# Altium project Freezer Relay Control.PrjPcb
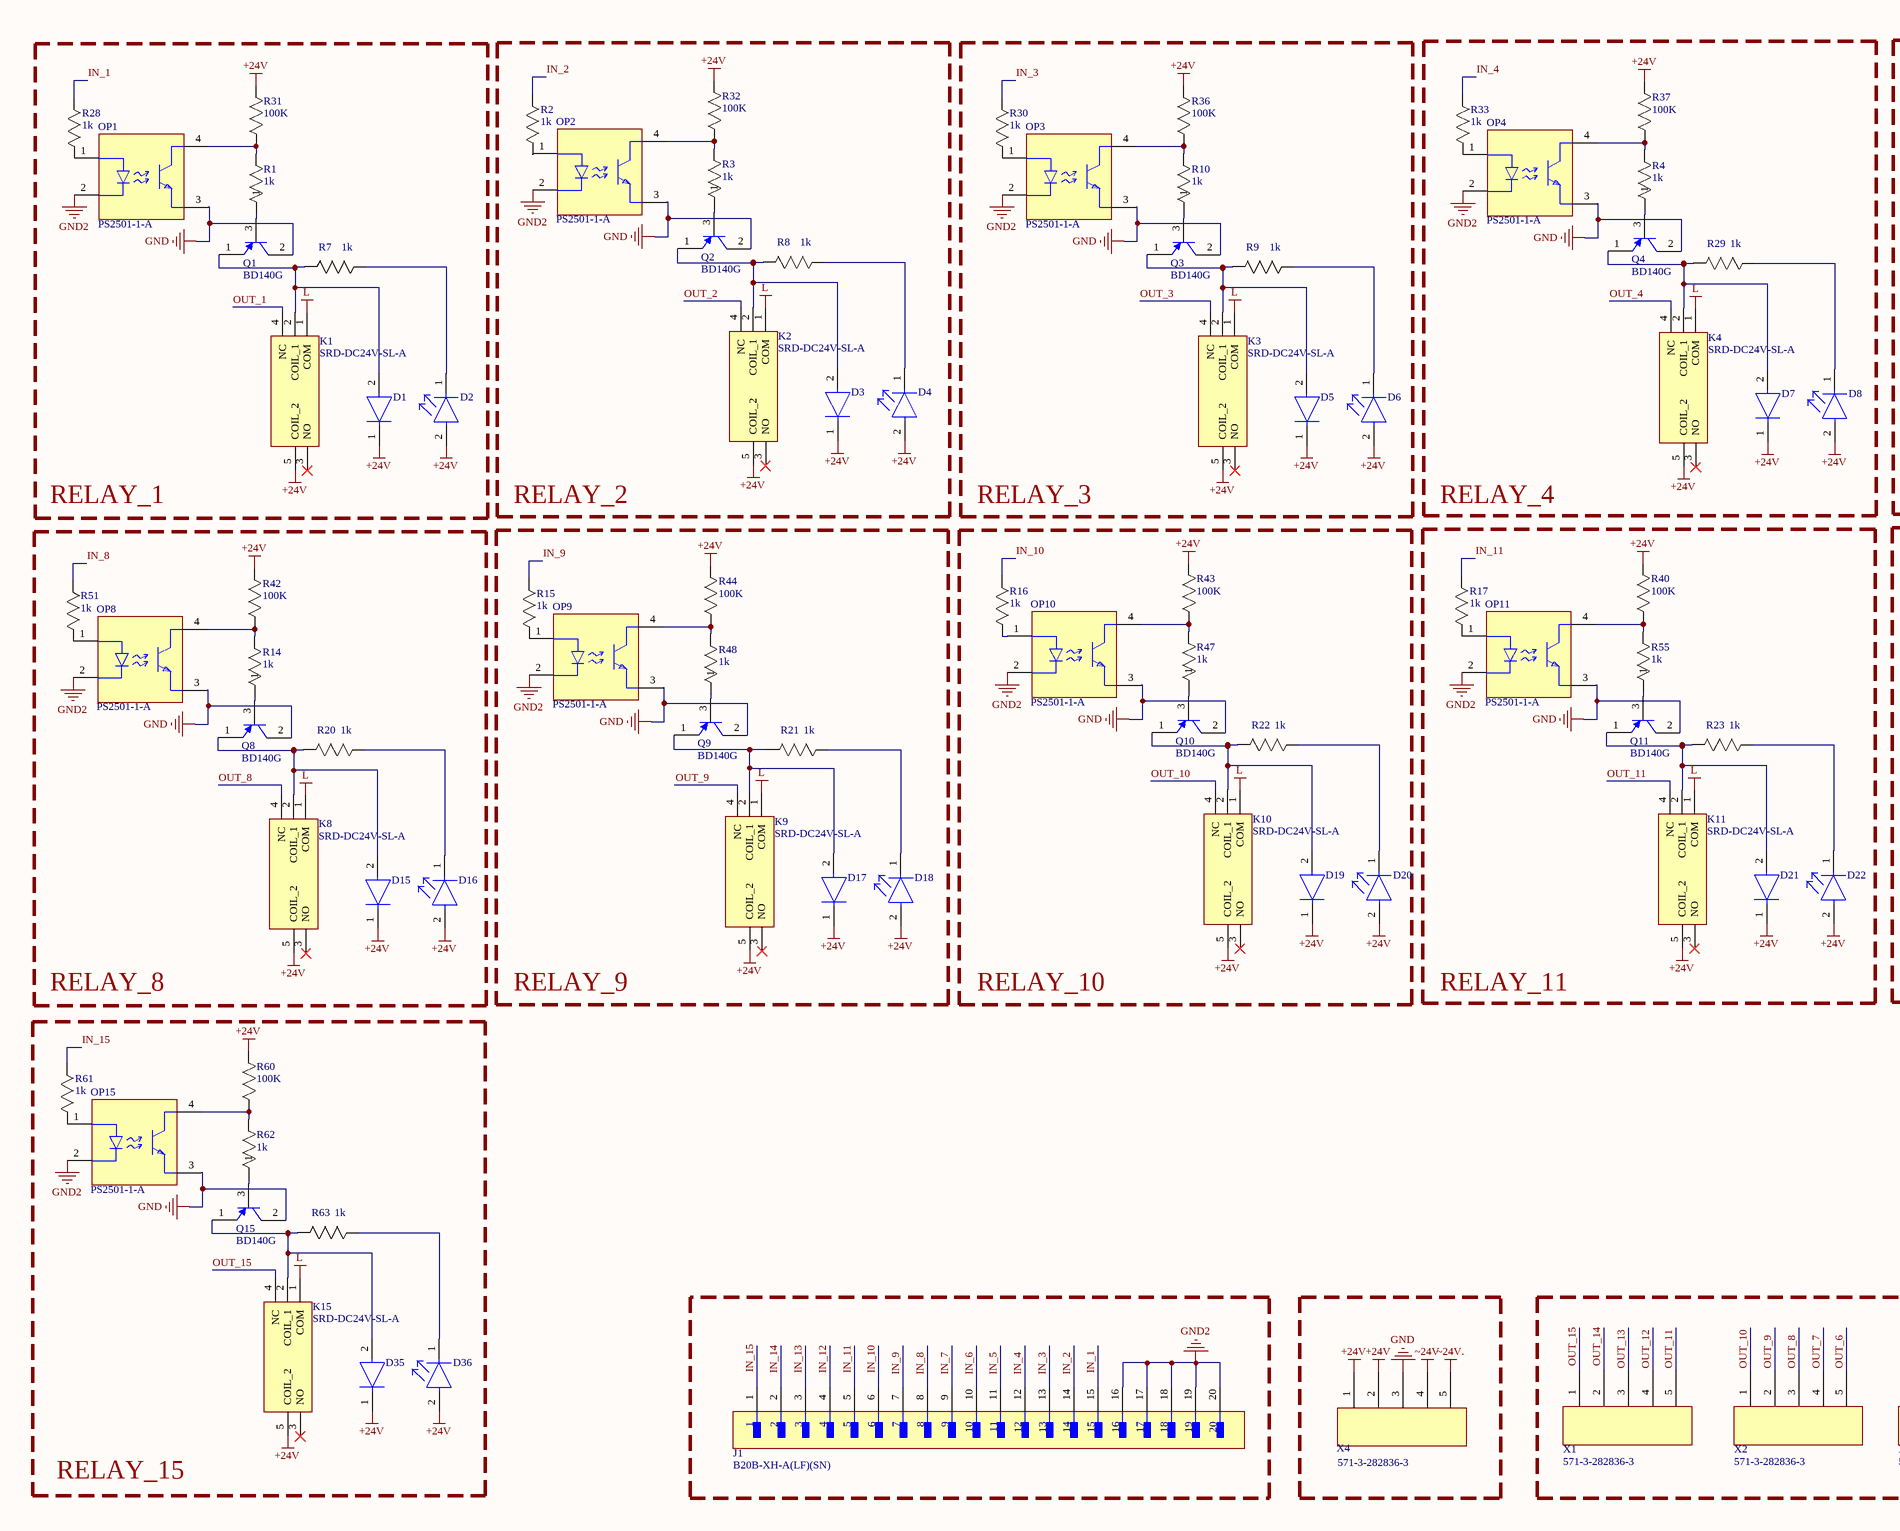
[diagram p0: Relay_Scch.SchDoc, left]
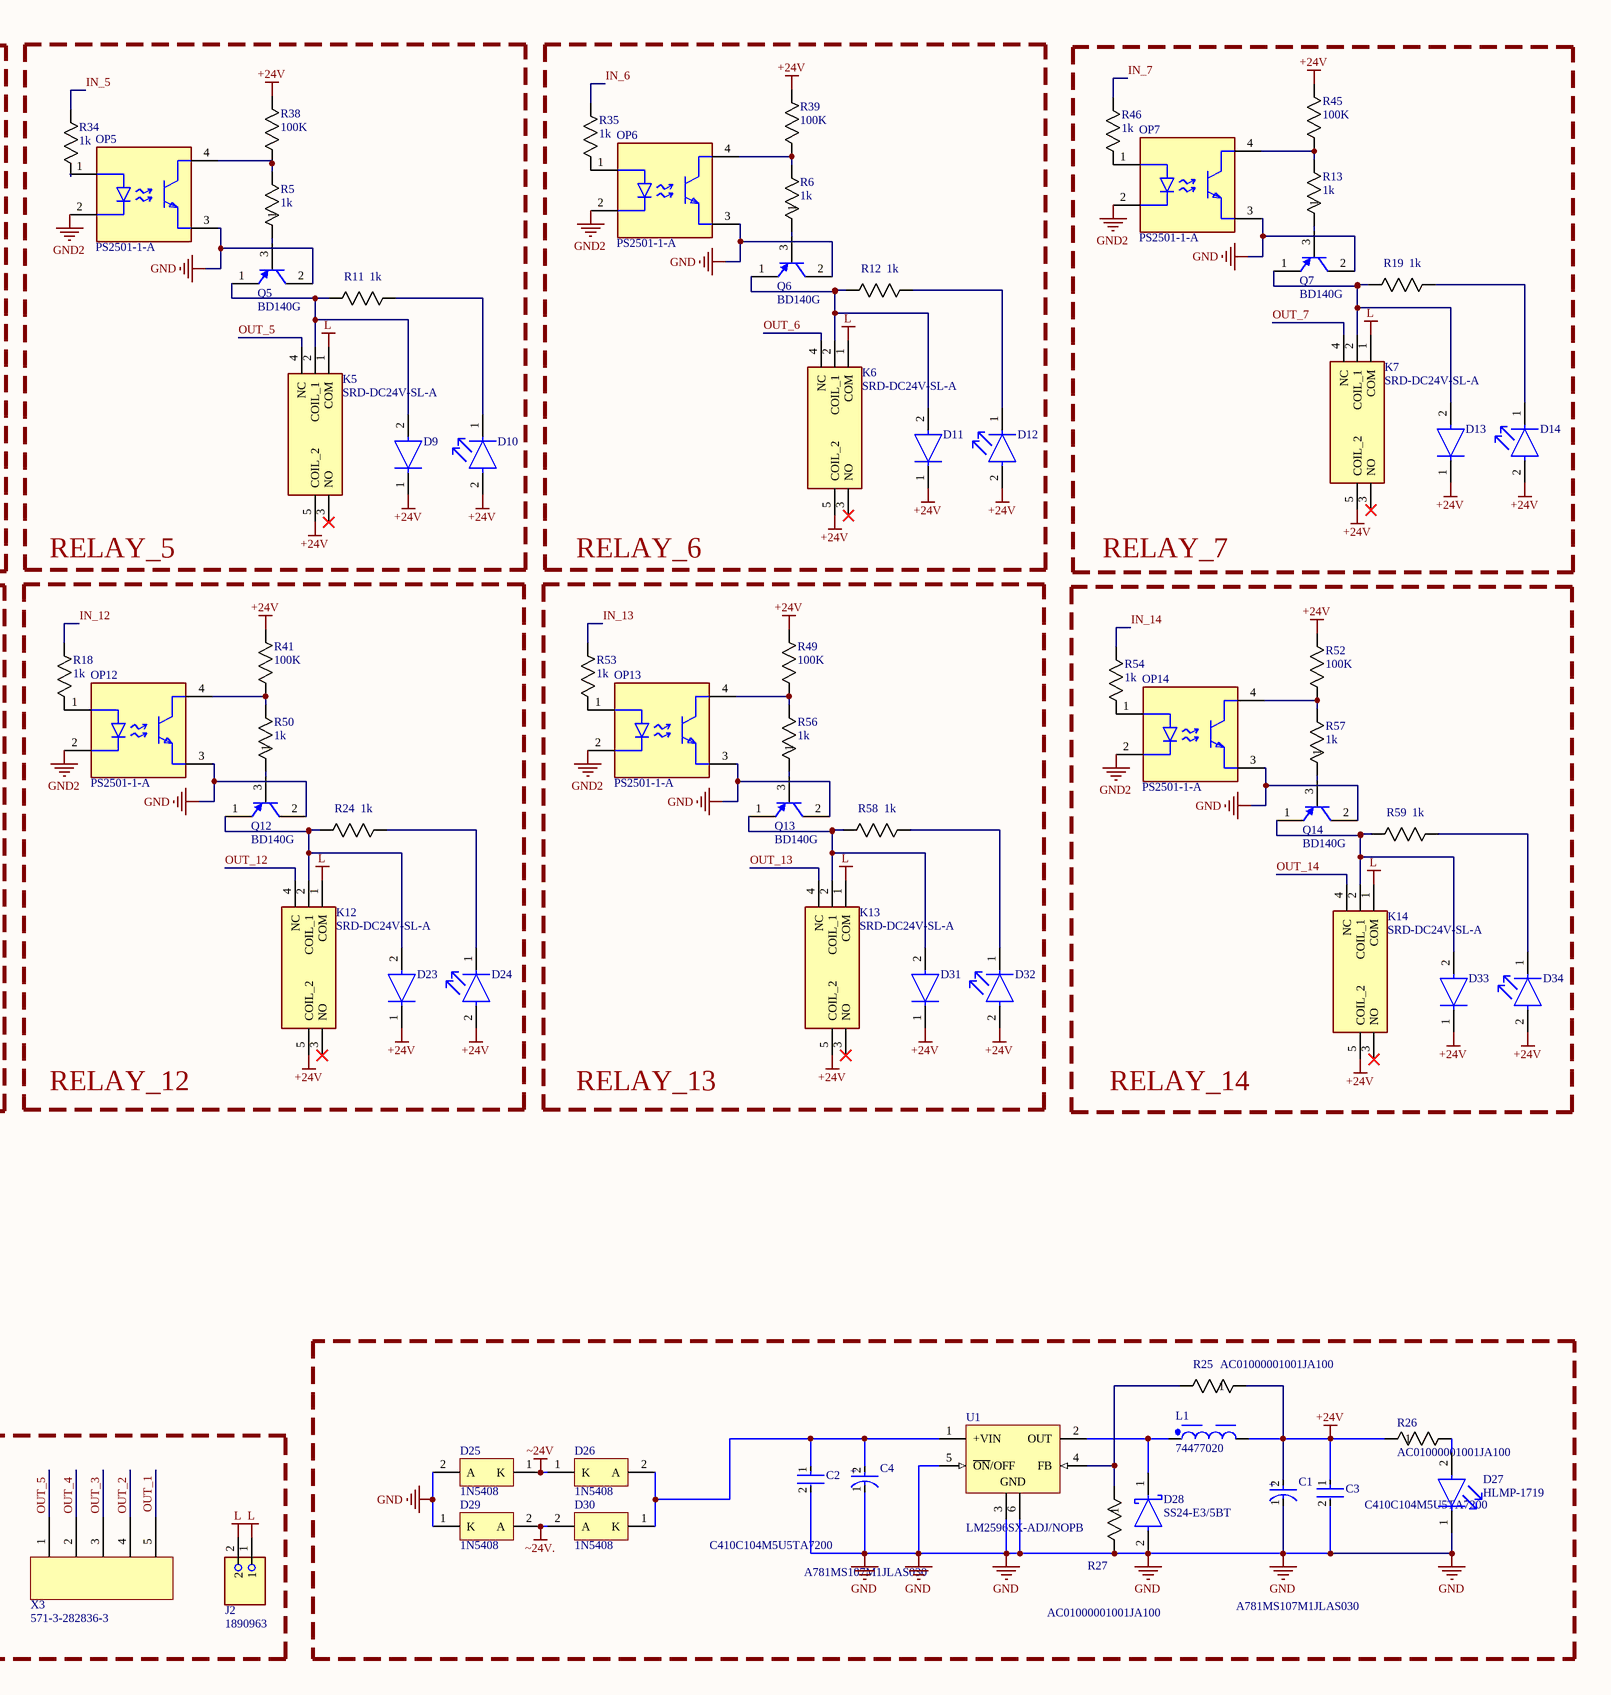
[diagram p1: Relay_Scch.SchDoc, right]
1 sheet, 156 parts. Net scope: global (net labels, ports and power ports of the same name join across sheets).
Board file: Relay_PCB.PcbDoc

## Sheet Relay_Scch.SchDoc
size 762 x 330 mm; SheetNumber: 1; SheetTotal: 1

### Parts
C1  A781MS107M1JLAS030  [FP-A781MS-S-MFG]
C2  C410C104M5U5TA7200  [FP-C410C104M5U5TA7200-MFG]
C3  C410C104M5U5TA7200  [FP-C410C104M5U5TA7200-MFG]
C4  A781MS107M1JLAS030  [FP-A781MS-S-MFG]
D1  1N4007  [FP-1N4007-MFG]  (value not drawn)
D2  HLMP-1719  [FP-HLMP-1719-MFG]  (value not drawn)
D3  1N4007  [FP-1N4007-MFG]  (value not drawn)
D4  HLMP-1719  [FP-HLMP-1719-MFG]  (value not drawn)
D5  1N4007  [FP-1N4007-MFG]  (value not drawn)
D6  HLMP-1719  [FP-HLMP-1719-MFG]  (value not drawn)
D7  1N4007  [FP-1N4007-MFG]  (value not drawn)
D8  HLMP-1719  [FP-HLMP-1719-MFG]  (value not drawn)
D9  1N4007  [FP-1N4007-MFG]  (value not drawn)
D10  HLMP-1719  [FP-HLMP-1719-MFG]  (value not drawn)
D11  1N4007  [FP-1N4007-MFG]  (value not drawn)
D12  HLMP-1719  [FP-HLMP-1719-MFG]  (value not drawn)
D13  1N4007  [FP-1N4007-MFG]  (value not drawn)
D14  HLMP-1719  [FP-HLMP-1719-MFG]  (value not drawn)
D15  1N4007  [FP-1N4007-MFG]  (value not drawn)
D16  HLMP-1719  [FP-HLMP-1719-MFG]  (value not drawn)
D17  1N4007  [FP-1N4007-MFG]  (value not drawn)
D18  HLMP-1719  [FP-HLMP-1719-MFG]  (value not drawn)
D19  1N4007  [FP-1N4007-MFG]  (value not drawn)
D20  HLMP-1719  [FP-HLMP-1719-MFG]  (value not drawn)
D21  1N4007  [FP-1N4007-MFG]  (value not drawn)
D22  HLMP-1719  [FP-HLMP-1719-MFG]  (value not drawn)
D23  1N4007  [FP-1N4007-MFG]  (value not drawn)
D24  HLMP-1719  [FP-HLMP-1719-MFG]  (value not drawn)
D25  1N5408  [ONSC-AXIAL_LEAD-2-267-05_V]
D26  1N5408  [ONSC-AXIAL_LEAD-2-267-05_V]
D27  HLMP-1719  [FP-HLMP-1719-MFG]
D28  SS24-E3/5BT  [FP-95401-MFG]
D29  1N5408  [ONSC-AXIAL_LEAD-2-267-05_V]
D30  1N5408  [ONSC-AXIAL_LEAD-2-267-05_V]
D31  1N4007  [FP-1N4007-MFG]  (value not drawn)
D32  HLMP-1719  [FP-HLMP-1719-MFG]  (value not drawn)
D33  1N4007  [FP-1N4007-MFG]  (value not drawn)
D34  HLMP-1719  [FP-HLMP-1719-MFG]  (value not drawn)
D35  1N4007  [FP-1N4007-MFG]  (value not drawn)
D36  HLMP-1719  [FP-HLMP-1719-MFG]  (value not drawn)
J1  B20B-XH-A(LF)(SN)  [FP-B20B-XH-A_LF_SN-MFG]
J2  1890963  [PHOENIX_1890963]
K1  SRD-DC24V-SL-A  [srd24vdcslc]
K2  SRD-DC24V-SL-A  [srd24vdcslc]
K3  SRD-DC24V-SL-A  [srd24vdcslc]
K4  SRD-DC24V-SL-A  [srd24vdcslc]
K5  SRD-DC24V-SL-A  [srd24vdcslc]
K6  SRD-DC24V-SL-A  [srd24vdcslc]
K7  SRD-DC24V-SL-A  [srd24vdcslc]
K8  SRD-DC24V-SL-A  [srd24vdcslc]
K9  SRD-DC24V-SL-A  [srd24vdcslc]
K10  SRD-DC24V-SL-A  [srd24vdcslc]
K11  SRD-DC24V-SL-A  [srd24vdcslc]
K12  SRD-DC24V-SL-A  [srd24vdcslc]
K13  SRD-DC24V-SL-A  [srd24vdcslc]
K14  SRD-DC24V-SL-A  [srd24vdcslc]
K15  SRD-DC24V-SL-A  [srd24vdcslc]
L1  74477020  [WE-PD_1280]
OP1  PS2501-1-A  [FP-PS2501-1-A-MFG]
OP2  PS2501-1-A  [FP-PS2501-1-A-MFG]
OP3  PS2501-1-A  [FP-PS2501-1-A-MFG]
OP4  PS2501-1-A  [FP-PS2501-1-A-MFG]
OP5  PS2501-1-A  [FP-PS2501-1-A-MFG]
OP6  PS2501-1-A  [FP-PS2501-1-A-MFG]
OP7  PS2501-1-A  [FP-PS2501-1-A-MFG]
OP8  PS2501-1-A  [FP-PS2501-1-A-MFG]
OP9  PS2501-1-A  [FP-PS2501-1-A-MFG]
OP10  PS2501-1-A  [FP-PS2501-1-A-MFG]
OP11  PS2501-1-A  [FP-PS2501-1-A-MFG]
OP12  PS2501-1-A  [FP-PS2501-1-A-MFG]
OP13  PS2501-1-A  [FP-PS2501-1-A-MFG]
OP14  PS2501-1-A  [FP-PS2501-1-A-MFG]
OP15  PS2501-1-A  [FP-PS2501-1-A-MFG]
Q1  BD140G  [ONSC-TO-225-3-77-09]
Q2  BD140G  [ONSC-TO-225-3-77-09]
Q3  BD140G  [ONSC-TO-225-3-77-09]
Q4  BD140G  [ONSC-TO-225-3-77-09]
Q5  BD140G  [ONSC-TO-225-3-77-09]
Q6  BD140G  [ONSC-TO-225-3-77-09]
Q7  BD140G  [ONSC-TO-225-3-77-09]
Q8  BD140G  [ONSC-TO-225-3-77-09]
Q9  BD140G  [ONSC-TO-225-3-77-09]
Q10  BD140G  [ONSC-TO-225-3-77-09]
Q11  BD140G  [ONSC-TO-225-3-77-09]
Q12  BD140G  [ONSC-TO-225-3-77-09]
Q13  BD140G  [ONSC-TO-225-3-77-09]
Q14  BD140G  [ONSC-TO-225-3-77-09]
Q15  BD140G  [ONSC-TO-225-3-77-09]
R1  1k  [RES_AC01_VIS]
R2  1k  [RES_AC01_VIS]
R3  1k  [RES_AC01_VIS]
R4  1k  [RES_AC01_VIS]
R5  1k  [RES_AC01_VIS]
R6  1k  [RES_AC01_VIS]
R7  1k  [RES_AC01_VIS]
R8  1k  [RES_AC01_VIS]
R9  1k  [RES_AC01_VIS]
R10  1k  [RES_AC01_VIS]
R11  1k  [RES_AC01_VIS]
R12  1k  [RES_AC01_VIS]
R13  1k  [RES_AC01_VIS]
R14  1k  [RES_AC01_VIS]
R15  1k  [RES_AC01_VIS]
R16  1k  [RES_AC01_VIS]
R17  1k  [RES_AC01_VIS]
R18  1k  [RES_AC01_VIS]
R19  1k  [RES_AC01_VIS]
R20  1k  [RES_AC01_VIS]
R21  1k  [RES_AC01_VIS]
R22  1k  [RES_AC01_VIS]
R23  1k  [RES_AC01_VIS]
R24  1k  [RES_AC01_VIS]
R25  AC01000001001JA100  [RES_AC01_VIS]
R26  AC01000001001JA100  [RES_AC01_VIS]
R27  AC01000001001JA100  [RES_AC01_VIS]
R28  1k  [RES_AC01_VIS]
R29  1k  [RES_AC01_VIS]
R30  1k  [RES_AC01_VIS]
R31  100K  [RES_AC01_VIS]
R32  100K  [RES_AC01_VIS]
R33  1k  [RES_AC01_VIS]
R34  1k  [RES_AC01_VIS]
R35  1k  [RES_AC01_VIS]
R36  100K  [RES_AC01_VIS]
R37  100K  [RES_AC01_VIS]
R38  100K  [RES_AC01_VIS]
R39  100K  [RES_AC01_VIS]
R40  100K  [RES_AC01_VIS]
R41  100K  [RES_AC01_VIS]
R42  100K  [RES_AC01_VIS]
R43  100K  [RES_AC01_VIS]
R44  100K  [RES_AC01_VIS]
R45  100K  [RES_AC01_VIS]
R46  1k  [RES_AC01_VIS]
R47  1k  [RES_AC01_VIS]
R48  1k  [RES_AC01_VIS]
R49  100K  [RES_AC01_VIS]
R50  1k  [RES_AC01_VIS]
R51  1k  [RES_AC01_VIS]
R52  100K  [RES_AC01_VIS]
R53  1k  [RES_AC01_VIS]
R54  1k  [RES_AC01_VIS]
R55  1k  [RES_AC01_VIS]
R56  1k  [RES_AC01_VIS]
R57  1k  [RES_AC01_VIS]
R58  1k  [RES_AC01_VIS]
R59  1k  [RES_AC01_VIS]
R60  100K  [RES_AC01_VIS]
R61  1k  [RES_AC01_VIS]
R62  1k  [RES_AC01_VIS]
R63  1k  [RES_AC01_VIS]
U1  LM2596SX-ADJ/NOPB  [KTT0005B_L]
X1  571-3-282836-3  [PCBComponent_1]
X2  571-3-282836-3  [PCBComponent_1]
X3  571-3-282836-3  [PCBComponent_1]
X4  571-3-282836-3  [PCBComponent_1]

### Blocks framed on the sheet
RELAY_1: D1 D2 K1 OP1 Q1 R1 R7 R28 R31
RELAY_2: D3 D4 K2 OP2 Q2 R2 R3 R8 R32
RELAY_3: D5 D6 K3 OP3 Q3 R9 R10 R30 R36
RELAY_4: D7 D8 K4 OP4 Q4 R4 R29 R33 R37
RELAY_5: D9 D10 K5 OP5 Q5 R5 R11 R34 R38
RELAY_6: D11 D12 K6 OP6 Q6 R6 R12 R35 R39
RELAY_7: D13 D14 K7 OP7 Q7 R13 R19 R45 R46
RELAY_8: D15 D16 K8 OP8 Q8 R14 R20 R42 R51
RELAY_9: D17 D18 K9 OP9 Q9 R15 R21 R44 R48
RELAY_10: D19 D20 K10 OP10 Q10 R16 R22 R43 R47
RELAY_11: D21 D22 K11 OP11 Q11 R17 R23 R40 R55
RELAY_12: D23 D24 K12 OP12 Q12 R18 R24 R41 R50
RELAY_13: D31 D32 K13 OP13 Q13 R49 R53 R56 R58
RELAY_14: D33 D34 K14 OP14 Q14 R52 R54 R57 R59
RELAY_15: D35 D36 K15 OP15 Q15 R60-R63

### Nets
+24V: C1.2(A) C3.1 D1.1(C) D2.2(A) D3.1(C) D4.2(A) D5.1(C) D6.2(A) D7.1(C) D8.2(A) D9.1(C) D10.2(A) D11.1(C) D12.2(A) D13.1(C) D14.2(A) D15.1(C) D16.2(A) D17.1(C) D18.2(A) D19.1(C) D20.2(A) D21.1(C) D22.2(A) D23.1(C) D24.2(A) D31.1(C) D32.2(A) D33.1(C) D34.2(A) D35.1(C) D36.2(A) K1.5(COIL_2) K2.5(COIL_2) K3.5(COIL_2) K4.5(COIL_2) K5.5(COIL_2) K6.5(COIL_2) K7.5(COIL_2) K8.5(COIL_2) K9.5(COIL_2) K10.5(COIL_2) K11.5(COIL_2) K12.5(COIL_2) K13.5(COIL_2) K14.5(COIL_2) K15.5(COIL_2) L1.2 R25.1 R26.1 R31.2 R32.2 R36.2 R37.2 R38.2 R39.2 R40.2 R41.2 R42.2 R43.2 R44.2 R45.2 R49.2 R52.2 R60.2 X4.1 X4.2
GND: C1.1(C) C2.2 C3.2 C4.1(C) D25.2(A) D27.1(C) D28.2(A) D29.1(K) OP1.3(E) OP2.3(E) OP3.3(E) OP4.3(E) OP5.3(E) OP6.3(E) OP7.3(E) OP8.3(E) OP9.3(E) OP10.3(E) OP11.3(E) OP12.3(E) OP13.3(E) OP14.3(E) OP15.3(E) Q1.2(C) Q2.2(C) Q3.2(C) Q4.2(C) Q5.2(C) Q6.2(C) Q7.2(C) Q8.2(C) Q9.2(C) Q10.2(C) Q11.2(C) Q12.2(C) Q13.2(C) Q14.2(C) Q15.2(C) R27.2 U1.3(GND) U1.5(~{ON}/OFF) U1.6(GND) X4.3
GND2: J1.16 J1.17 J1.18 J1.19 J1.20 OP1.2(C) OP2.2(C) OP3.2(C) OP4.2(C) OP5.2(C) OP6.2(C) OP7.2(C) OP8.2(C) OP9.2(C) OP10.2(C) OP11.2(C) OP12.2(C) OP13.2(C) OP14.2(C) OP15.2(C)
L: J2.1 J2.2 K1.1(COM) K2.1(COM) K3.1(COM) K4.1(COM) K5.1(COM) K6.1(COM) K7.1(COM) K8.1(COM) K9.1(COM) K10.1(COM) K11.1(COM) K12.1(COM) K13.1(COM) K14.1(COM) K15.1(COM)
~24V: D25.1(K) D26.1(K) X4.4
~24V.: D29.2(A) D30.2(A) X4.5
IN_1: J1.15 R28.1
IN_2: J1.14 R2.1
IN_3: J1.13 R30.1
IN_4: J1.12 R33.1
IN_5: J1.11 R34.1
IN_6: J1.10 R35.1
IN_7: J1.9 R46.1
IN_8: J1.8 R51.1
IN_9: J1.7 R15.1
IN_10: J1.6 R16.1
IN_11: J1.5 R17.1
IN_12: J1.4 R18.1
IN_13: J1.3 R53.1
IN_14: J1.2 R54.1
IN_15: J1.1 R61.1
OUT_1: K1.4(NC) X3.5
OUT_2: K2.4(NC) X3.4
OUT_3: K3.4(NC) X3.3
OUT_4: K4.4(NC) X3.2
OUT_5: K5.4(NC) X3.1
OUT_6: K6.4(NC) X2.5
OUT_7: K7.4(NC) X2.4
OUT_8: K8.4(NC) X2.3
OUT_9: K9.4(NC) X2.2
OUT_10: K10.4(NC) X2.1
OUT_11: K11.4(NC) X1.5
OUT_12: K12.4(NC) X1.4
OUT_13: K13.4(NC) X1.3
OUT_14: K14.4(NC) X1.2
OUT_15: K15.4(NC) X1.1
NetC2_1: C2.1 C4.2(A) D26.2(A) D30.1(K) U1.1(+VIN)
NetD1_2: D1.2(A) K1.2(COIL_1) Q1.1(E) R7.2
NetD2_1: D2.1(C) R7.1
NetD3_2: D3.2(A) K2.2(COIL_1) Q2.1(E) R8.2
NetD4_1: D4.1(C) R8.1
NetD5_2: D5.2(A) K3.2(COIL_1) Q3.1(E) R9.2
NetD6_1: D6.1(C) R9.1
NetD7_2: D7.2(A) K4.2(COIL_1) Q4.1(E) R29.2
NetD8_1: D8.1(C) R29.1
NetD9_2: D9.2(A) K5.2(COIL_1) Q5.1(E) R11.2
NetD10_1: D10.1(C) R11.1
NetD11_2: D11.2(A) K6.2(COIL_1) Q6.1(E) R12.2
NetD12_1: D12.1(C) R12.1
NetD13_2: D13.2(A) K7.2(COIL_1) Q7.1(E) R19.2
NetD14_1: D14.1(C) R19.1
NetD15_2: D15.2(A) K8.2(COIL_1) Q8.1(E) R20.2
NetD16_1: D16.1(C) R20.1
NetD17_2: D17.2(A) K9.2(COIL_1) Q9.1(E) R21.2
NetD18_1: D18.1(C) R21.1
NetD19_2: D19.2(A) K10.2(COIL_1) Q10.1(E) R22.2
NetD20_1: D20.1(C) R22.1
NetD21_2: D21.2(A) K11.2(COIL_1) Q11.1(E) R23.2
NetD22_1: D22.1(C) R23.1
NetD23_2: D23.2(A) K12.2(COIL_1) Q12.1(E) R24.2
NetD24_1: D24.1(C) R24.1
NetD27_2: D27.2(A) R26.2
NetD28_1: D28.1(C) L1.1 U1.2(OUT)
NetD31_2: D31.2(A) K13.2(COIL_1) Q13.1(E) R58.2
NetD32_1: D32.1(C) R58.1
NetD33_2: D33.2(A) K14.2(COIL_1) Q14.1(E) R59.2
NetD34_1: D34.1(C) R59.1
NetD35_2: D35.2(A) K15.2(COIL_1) Q15.1(E) R63.2
NetD36_1: D36.1(C) R63.1
NetOP1_1: OP1.1(A) R28.2
NetOP1_4: OP1.4(C) R1.2 R31.1
NetOP2_1: OP2.1(A) R2.2
NetOP2_4: OP2.4(C) R3.2 R32.1
NetOP3_1: OP3.1(A) R30.2
NetOP3_4: OP3.4(C) R10.2 R36.1
NetOP4_1: OP4.1(A) R33.2
NetOP4_4: OP4.4(C) R4.2 R37.1
NetOP5_1: OP5.1(A) R34.2
NetOP5_4: OP5.4(C) R5.2 R38.1
NetOP6_1: OP6.1(A) R35.2
NetOP6_4: OP6.4(C) R6.2 R39.1
NetOP7_1: OP7.1(A) R46.2
NetOP7_4: OP7.4(C) R13.2 R45.1
NetOP8_1: OP8.1(A) R51.2
NetOP8_4: OP8.4(C) R14.2 R42.1
NetOP9_1: OP9.1(A) R15.2
NetOP9_4: OP9.4(C) R44.1 R48.2
NetOP10_1: OP10.1(A) R16.2
NetOP10_4: OP10.4(C) R43.1 R47.2
NetOP11_1: OP11.1(A) R17.2
NetOP11_4: OP11.4(C) R40.1 R55.2
NetOP12_1: OP12.1(A) R18.2
NetOP12_4: OP12.4(C) R41.1 R50.2
NetOP13_1: OP13.1(A) R53.2
NetOP13_4: OP13.4(C) R49.1 R56.2
NetOP14_1: OP14.1(A) R54.2
NetOP14_4: OP14.4(C) R52.1 R57.2
NetOP15_1: OP15.1(A) R61.2
NetOP15_4: OP15.4(C) R60.1 R62.2
NetQ1_3: Q1.3(B) R1.1
NetQ2_3: Q2.3(B) R3.1
NetQ3_3: Q3.3(B) R10.1
NetQ4_3: Q4.3(B) R4.1
NetQ5_3: Q5.3(B) R5.1
NetQ6_3: Q6.3(B) R6.1
NetQ7_3: Q7.3(B) R13.1
NetQ8_3: Q8.3(B) R14.1
NetQ9_3: Q9.3(B) R48.1
NetQ10_3: Q10.3(B) R47.1
NetQ11_3: Q11.3(B) R55.1
NetQ12_3: Q12.3(B) R50.1
NetQ13_3: Q13.3(B) R56.1
NetQ14_3: Q14.3(B) R57.1
NetQ15_3: Q15.3(B) R62.1
NetR25_2: R25.2 R27.1 U1.4(FB)

Not connected (* = marked no-connect by the designer): K1 3(NO)*; K2 3(NO)*; K3 3(NO)*; K4 3(NO)*; K5 3(NO)*; K6 3(NO)*; K7 3(NO)*; K8 3(NO)*; K9 3(NO)*; K10 3(NO)*; K11 3(NO)*; K12 3(NO)*; K13 3(NO)*; K14 3(NO)*; K15 3(NO)*

### Notes on the sheet
- (in symbol CMP-03016-000042-1) +

### Library data of the parts
C1 C4 = CMP-03016-000042-1: HYBRID POLYMER, V-CHIP, AEC-Q200
C2 C3 = CMP-03020-034640-1: CAP CER 0.1UF 50V Z5U AXIAL; Capacitance: 100nF; Tolerance: 20%; Lead Diameter: 0.51mm; Dissipation Factor: 4%; Lead Length: 25.4mm; Mount: Through Hole; Length: 4.32mm; Lead Free: Lead Free; Number of Pins: 2; Case/Package: Axial; Max Operating Temperature: 85°C; RoHS Compliant: Yes; Dielectric: Z5U; Min Operating Temperature: 10°C; Series: Aximax 400; Termination: Axial; Radiation Hardening: No; Voltage Rating (DC): 50V; REACH SVHC: No SVHC; Construction: AXIAL; Package Quantity: 5000; Packaging: Tape and Reel; Voltage Rating: 50V
D1 D3 D5 D7 D9 D11 D13 D15 D17 D19 D21 D23 D31 D33 D35 = CMP-123542-000001-1: Rectifier diode 1000 V 1 A DO-41, ,; Manufacturer: Diotec; Max Surge Forward Current: 27A; Forward Current: 1A; Max Junction Temp: +175°C; Reverse Voltage: 1000V; Value: 15pF; Peak Reverse Current: 5uA; Category: Diode; Temperature Range Low: -50°C; Automotive: No; Temperature: -50°C to +175°C; Lead Free: Yes; ComponentLink2Description: Datasheet; Max Repetitive Reverse Voltage: 1000V; ComponentLink2URL: https://datasheet.octopart.com/1N4007-Diotec-datasheet-62346875.pdf; Manufacturer Part Number: 1N4007; Device Class L3: Rectifier Diodes; Height: 2.8mm; Octopart: https://octopart.com/1n4007-diotec-4040411; Package: 1N4007; Temperature Range High: +175°C; Device Class L1: Discrete Semiconductors; Device Class L2: Diodes; RoHS: TRUE; Capacitance: 15pF; Ipc Land Pattern Name: DIOAD888W100L520D280
D2 D4 D6 D8 D10 D12 D14 D16 D18 D20 D22 D24 D27 D32 D34 D36 = CMP-2000-06410-2: LED YELLOW DIFFUSED T-1 T/H; Manufacturer: Broadcom; Wavelength: 585nm; Led Orientation: Straight; Luminous Intensity: 2.1mcd; Forward Voltage: 1.8V; Viewing Angle: 50°; Reverse Voltage: 5V; Power Dissipation: 17.5mW; Forward Current: 2mA; Lead Free: Yes; Automotive: No; Device Class L1: Optoelectronics; Mouser Description: Standard LEDs - Through Hole Yellow Diffused 585nm 2.1mcd; Digikey Description: LED YELLOW DIFFUSED T-1 T/H; Temperature: -40°C to +100°C; Temperature Range High: +100°C; Package: 0; Category: Diode; Colour: Yellow; Device Class L2: LEDs; ComponentLink2Description: Datasheet; ComponentLink2URL: https://docs.broadcom.com/docs/AV02-1557EN; Temperature Range Low: -40°C; Device Class L3: unset; Octopart: https://octopart.com/hlmp-1719-broadcom-71130405; RoHS: TRUE; Manufacturer Part Number: HLMP-1719
D25 D26 D29 D30 = CMP-0902-00037-1: Standard Recovery Rectifier, 2-Pin Axial_Lead, Pb-Free, Bulk Box; Manufacturer: On Semiconductor; IFSM Max (A): 200; IO(rec) Max (A): 3; VRRM Max (V): 1000; RoHS: TRUE; ComponentLink3URL: http://www.onsemi.com/pub_link/Collateral/267-05.PDF; ComponentLink2URL: http://www.onsemi.com/pub_link/Collateral/1N5400-D.PDF; ComponentLink3Description: Package Specification; Mounting Technology: Through Hole; PartNumber: 1N5408; Type: Standard Recovery; PackageDescription: 2-Pin, Axial Lead, Diameter 5.05 mm; Packing: Bulk Box; PackageReference: AXIAL_LEAD-2-267-05; ComponentLink2Description: Datasheet; DatasheetVersion: Rev. 10; ComponentLink1Description: Manufacturer URL; PackageVersion: Rev. G, 06/2000; ComponentLink1URL: http://www.onsemi.com/
D28 = CMP-00030-42277690-1: SS24-E3/5BT Rectifier Diode, Schottky, 1 Phase, 1 Element, 2A, 40V V(RRM), Silicon, DO-214AA; Forward Voltage: 500mV; Max Reverse Leakage Current: 400µA; Element Configuration: Single; Max Forward Surge Current (Ifsm): 75A; Lead Free: Lead Free; Width: 3.8mm; Max Reverse Voltage (DC): 40V; Max Operating Temperature: 125°C; Min Operating Temperature: -65°C; RoHS: Compliant; Mount: Surface Mount; Average Rectified Current: 2A; Contact Plating: Tin; Max Repetitive Reverse Voltage (Vrrm): 40V; NexarPartId: 42277690; Case/Package: SMB; Number of Pins: 2; Forward Current: 2A; Peak Reverse Current: 400µA; Length: 4.7mm; Peak Non-Repetitive Surge Current: 75A; Max Surge Current: 75A; Radiation Hardening: No
J1 = CMP-17439-000690-1: CONN HEADER VERT 20POS 2.5MM; Connector Type: Male Pin; Pitch: 0.098inch; Number of Positions: 20; Termination: Press-Fit; Contact Plating: Tin; Lead Free: Lead Free; Color: Natural; Packaging: Bulk; Series: XH; Fastening Type: Detent; Contact Type: Male Pin; Mount: Through Hole; Number of Rows: 1
K1-K15 = srd-24vdc-sl-c: Relay or Contactor; Manufacturer_Name: EAGLE; Datasheet Link: https://pdf1.alldatasheet.com/datasheet-pdf/view/1132032/SONGLERELAY/SRD-24VDC-SL-C.html; Height: 15.3mm; Manufacturer_Part_Number: srd-24vdc-sl-c
L1 = CMP-0227-00167-2: NexarPartId: 8917151; DC Resistance (DCR): 117mΩ; Shielding: Shielded; Tolerance: 20%; Current Rating: 2.2A; Resistance: 220mΩ; Core Material: Ferrite; Self Resonant Frequency: 5.2MHz; Inductance: 100µH; Test Frequency: 1kHz; Saturation Current: 2.4A; Depth: 12mm; Weight: 18.143695g; Inductance Tolerance: 20%; Max DC Current: 2.2A; Case/Package: Nonstandard; Height: 8mm; RMS Current (Irms): 2.2A; Length: 12mm; Lead Pitch: 7mm; REACH SVHC: Unknown; Packaging: Tape & Reel (TR); Ambient Temperature Range High: 85°C; Composition: Wirewound; Ambient Temperature Range Low: -40°C; Max Operating Temperature: 125°C; Mount: Surface Mount; Series Resistance: 220mΩ; RoHS: Compliant; Min Operating Temperature: -40°C; Width: 12mm; Termination: SMD/SMT; Number of Pins: 2; Height - Seated (Max): 8.001mm
OP1-OP15 = CMP-13576-000004-1: OPTOISOLATOR 5KV TRANS 4DIP; Reverse Breakdown Voltage: 6V; Collector Emitter Saturation Voltage: 300mV; Current Transfer Ratio: 600%; Collector Emitter Voltage (VCEO): 80V; Forward Current: 80mA; Input Type: DC; Number of Elements: 1; Forward Voltage: 1.4V; Number of Pins: 4; Case/Package: PDIP; Isolation Voltage: 5kV; Max Operating Temperature: 100°C; Radiation Hardening: No; RoHS Compliant: Yes; Min Operating Temperature: -55°C; Mount: Through Hole
Q1-Q15 = CMP-1048-01270-1: Plastic Medium-Power Silicon PNP Transistor, 3-Pin TO-225, Pb-Free, Bulk Box; Manufacturer: ON Semiconductor; IC Continuous (A): 1.5; PartNumber: BD140G; PackageVersion: Rev. AC, 12/2013; ComponentLink1URL: http://www.onsemi.com/; Packing: Bulk Box; ComponentLink1Description: Manufacturer URL; ComponentLink2URL: http://www.onsemi.com/pub_link/Collateral/BD136-D.PDF; ComponentLink3Description: Package Specification; Polarity: PNP; PackageReference: TO-225-3-77-09; ComponentLink3URL: http://www.onsemi.com/pub_link/Collateral/77-09.PDF; Mounting Technology: Through Hole; PackageDescription: 3-Pin Flange Mount, Vertical Straight Lead, Body 7.6 x 2.7 mm, Pitch 2.29 mm; DatasheetVersion: Rev. 15; RoHS: TRUE; ComponentLink2Description: Datasheet; Manufacturer Part Number: BD140G
R1-R63 = CMP-T1-00030-42521882-4: VISHAY AC01000001001JA100 Through Hole Resistor, 1 kohm, Axial Leaded, 1 W, 5%, AC Series; Lead Diameter: 800µm; Power Rating: 1W; Temperature Coefficient: 180ppm/°C; Voltage Rating (DC): 32V; Resistance: 1kΩ; Lead Free: Lead Free; Features: Flame Retardant Coating; RoHS: Compliant; Radiation Hardening: No; Packaging: Tape & Box (TB); Length: 11mm; Min Operating Temperature: -40°C; Military Standard: Not; Case/Package: Axial; Number of Pins: 2; Diameter: 4.3mm; Tolerance: 5%; Contact Plating: Tin; NexarPartId: 42521882; Number of Terminations: 2; REACH SVHC: Unknown; Termination: Axial; Composition: Wirewound; Max Power Dissipation: 1W; Max Operating Temperature: 275°C; Schedule B: 8533210080, 8533210080
U1 = CMP-2000-06545-1: Simple Switcher(R) Power Converter 150 kHz Step-Down Voltage Regulator, 3 A, 4.5 to 40 V, -40 to 125 degC, 5-Pin TO-263 (KTT), Green (RoHS & no Sb/Br), Tape and Reel; PartNumber: LM2596; Manufacturer: Texas Instruments; Package Version: 4200577-4/G, 01/2013; Primary Input Voltage: 40V; No. of Outputs: 1; No. of Pins: 5; SVHC: NoSVHC(19-Dec-2012); Output Voltage: 37V; Output Current: 3A; Datasheet Version: Rev. C, 04/2013; Package Reference: KTT5; MSL: MSL3-168hours; Number of Outputs: 1; Operating Temperature Min: -40°C; Operating Temperature Range: -40°Cto+125°C; Manufacturer URL: http://www.ti.com/; Package URL: http://www.ti.com/litv/pdf/mpsf007e; Voltage Regulator Case Style: TO-263; Operating Temperature Max: 125°C; Package Description: 5-Pin Plastic Flange Mount, Body 10.16 x 8.925 mm, Pitch 1.7 mm; Datasheet URL: http://www.ti.com/lit/ds/symlink/lm2596.pdf; Mounting Technology: SurfaceMount
X1-X4 = Connector
J2 = 1890963: Package: None; Price: None; Value: *; MP: 1890963; Availability: Unavailable